# EAGLE design LTX-Rapidfire (EAGLE 7.7.0)

## Sheet 1 of 2
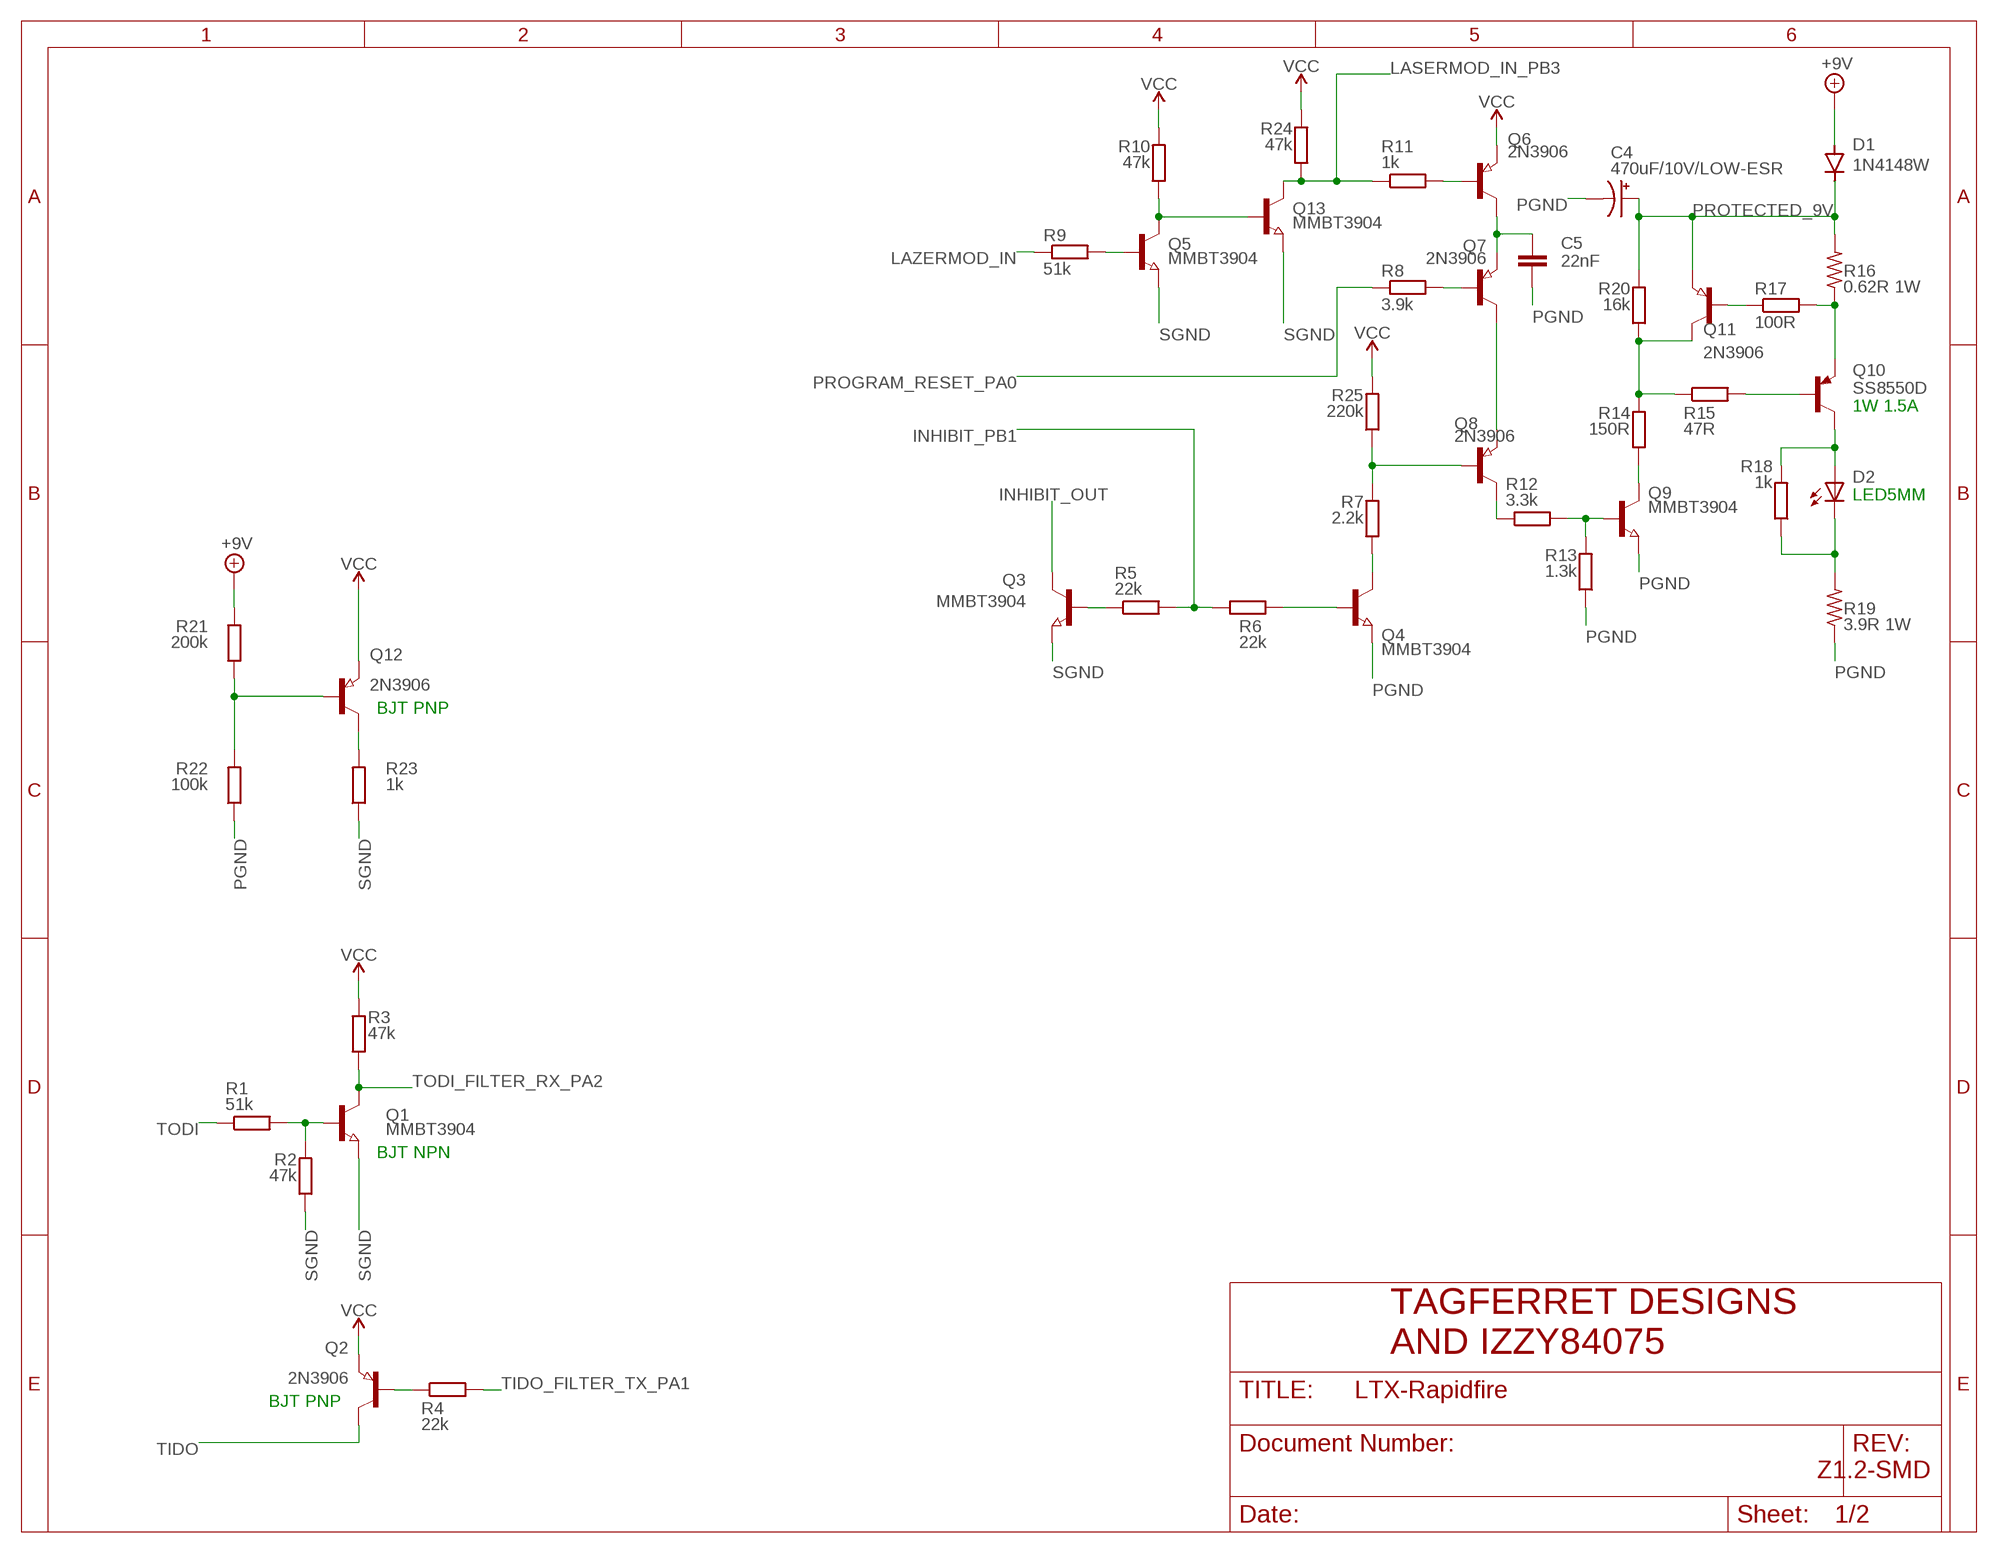
[diagram p0: schematic, sheet 1]

### Parts
C4  470uF/10V/LOW-ESR  CPOL-USE3.5-8  [E3,5-8]
C5  22nF  C_22NF/50V_0603  [C0603]
D1  1N4148W  D_1N4148W_ST_SOD123  [SOD123]
D2  LED5MM  [LED5MM]
Q1  MMBT3904  T_NPN_MMBT3904_CHANGJ_SOT23-BEC  [SOT23]
Q2  2N3906  T_PNP_MMBT5401_CHANGJ_SOT23-BEC  [SOT23]
Q3  MMBT3904  T_NPN_MMBT3904_CHANGJ_SOT23-BEC  [SOT23]
Q4  MMBT3904  T_NPN_MMBT3904_CHANGJ_SOT23-BEC  [SOT23]
Q5  MMBT3904  T_NPN_MMBT3904_CHANGJ_SOT23-BEC  [SOT23]
Q6  2N3906  T_PNP_MMBT5401_CHANGJ_SOT23-BEC  [SOT23]
Q7  2N3906  T_PNP_MMBT5401_CHANGJ_SOT23-BEC  [SOT23]
Q8  2N3906  T_PNP_MMBT5401_CHANGJ_SOT23-BEC  [SOT23]
Q9  MMBT3904  T_NPN_MMBT3904_CHANGJ_SOT23-BEC  [SOT23]
Q10  SS8550D  2N3906  [TO92]
Q11  2N3906  T_PNP_MMBT5401_CHANGJ_SOT23-BEC  [SOT23]
Q12  2N3906  T_PNP_MMBT5401_CHANGJ_SOT23-BEC  [SOT23]
Q13  MMBT3904  T_NPN_MMBT3904_CHANGJ_SOT23-BEC  [SOT23]
R1  51k  R_51K_0603  [R0603]
R2  47k  R_47K_0603  [R0603]
R3  47k  R_47K_0603  [R0603]
R4  22k  R_22K_0603  [R0603]
R5  22k  R_22K_0603  [R0603]
R6  22k  R_22K_0603  [R0603]
R7  2.2k  R_2.2K_0603  [R0603]
R8  3.9k  R_3.9K_0603  [R0603]
R9  51k  R_51K_0603  [R0603]
R10  47k  R_47K_0603  [R0603]
R11  1k  R_1K_0603  [R0603]
R12  3.3k  R_3.3K_0603  [R0603]
R13  1.3k  R_2.2K_0603  [R0603]
R14  150R  R_150R_0603  [R0603]
R15  47R  R_47R_0603  [R0603]
R16  0.62R 1W  R-US_R2512  [R2512]
R17  100R  R_100R_0603  [R0603]
R18  1k  R_1K_0603  [R0603]
R19  3.9R 1W  R-US_R2512  [R2512]
R20  16k  R_16K_0805  [R0805]
R21  200k  R_200K_0603  [R0603]
R22  100k  R_100K_0603  [R0603]
R23  1k  R_1K_0603  [R0603]
R24  47k  R_47K_0603  [R0603]
R25  220k  R_220K_0603  [R0603]

### Nets
+9V: D1.A R21.2 ; also sheet 2
INHIBIT_OUT: Q3.3(C) ; also sheet 2
INHIBIT_PB1: R5.2 R6.1 ; also sheet 2
LASERMOD_IN_PB3: Q13.3(C) R11.1 R24.1 ; also sheet 2
LAZERMOD_IN: R9.1 ; also sheet 2
N$1: Q11.1(B) R17.1
N$3: Q10.3(E) R16.1 R17.2
N$4: Q11.3(C) R14.2 R15.1 R20.1
N$5: Q10.2(B) R15.2
N$6: Q9.3(C) R14.1
N$7: D2.K(C) R18.1 R19.2
N$8: D2.A Q10.1(C) R18.2
N$9: Q9.1(B) R12.2 R13.2
N$10: Q8.3(C) R12.1
N$11: Q7.3(C) Q8.2(E)
N$12: Q8.1(B) R7.2 R25.1
N$13: Q7.1(B) R8.2
N$14: Q4.3(C) R7.1
N$15: C5.1 Q6.3(C) Q7.2(E)
N$16: Q4.1(B) R6.2
N$17: Q12.3(C) R23.2
N$18: Q3.1(B) R5.1
N$19: Q6.1(B) R11.2
N$20: Q12.1(B) R21.1 R22.2
N$21: Q5.3(C) Q13.1(B) R10.1
N$22: Q5.1(B) R9.2
N$24: Q1.1(B) R1.2 R2.2
N$25: Q2.1(B) R4.1
PGND: C4.- C5.2 Q4.2(E) Q9.2(E) R13.1 R19.1 R22.1 ; also sheet 2
PROGRAM_RESET_PA0: R8.1 ; also sheet 2
PROTECTED_9V: C4.+ D1.C Q11.2(E) R16.2 R20.2
SGND: Q1.2(E) Q3.2(E) Q5.2(E) Q13.2(E) R2.1 R23.1 ; also sheet 2
TIDO: Q2.3(C) ; also sheet 2
TIDO_FILTER_TX_PA1: R4.2 ; also sheet 2
TODI: R1.1 ; also sheet 2
TODI_FILTER_RX_PA2: Q1.3(C) R3.1 ; also sheet 2
VCC: Q2.2(E) Q6.2(E) Q12.2(E) R3.2 R10.2 R24.2 R25.2 ; also sheet 2

### Notes on the sheet
- 1W 1.5A
- LED5MM
- BJT PNP
- BJT NPN
- TAGFERRET DESIGNS
  AND IZZY84075
- BJT PNP
- Z1.2-SMD

## Sheet 2 of 2
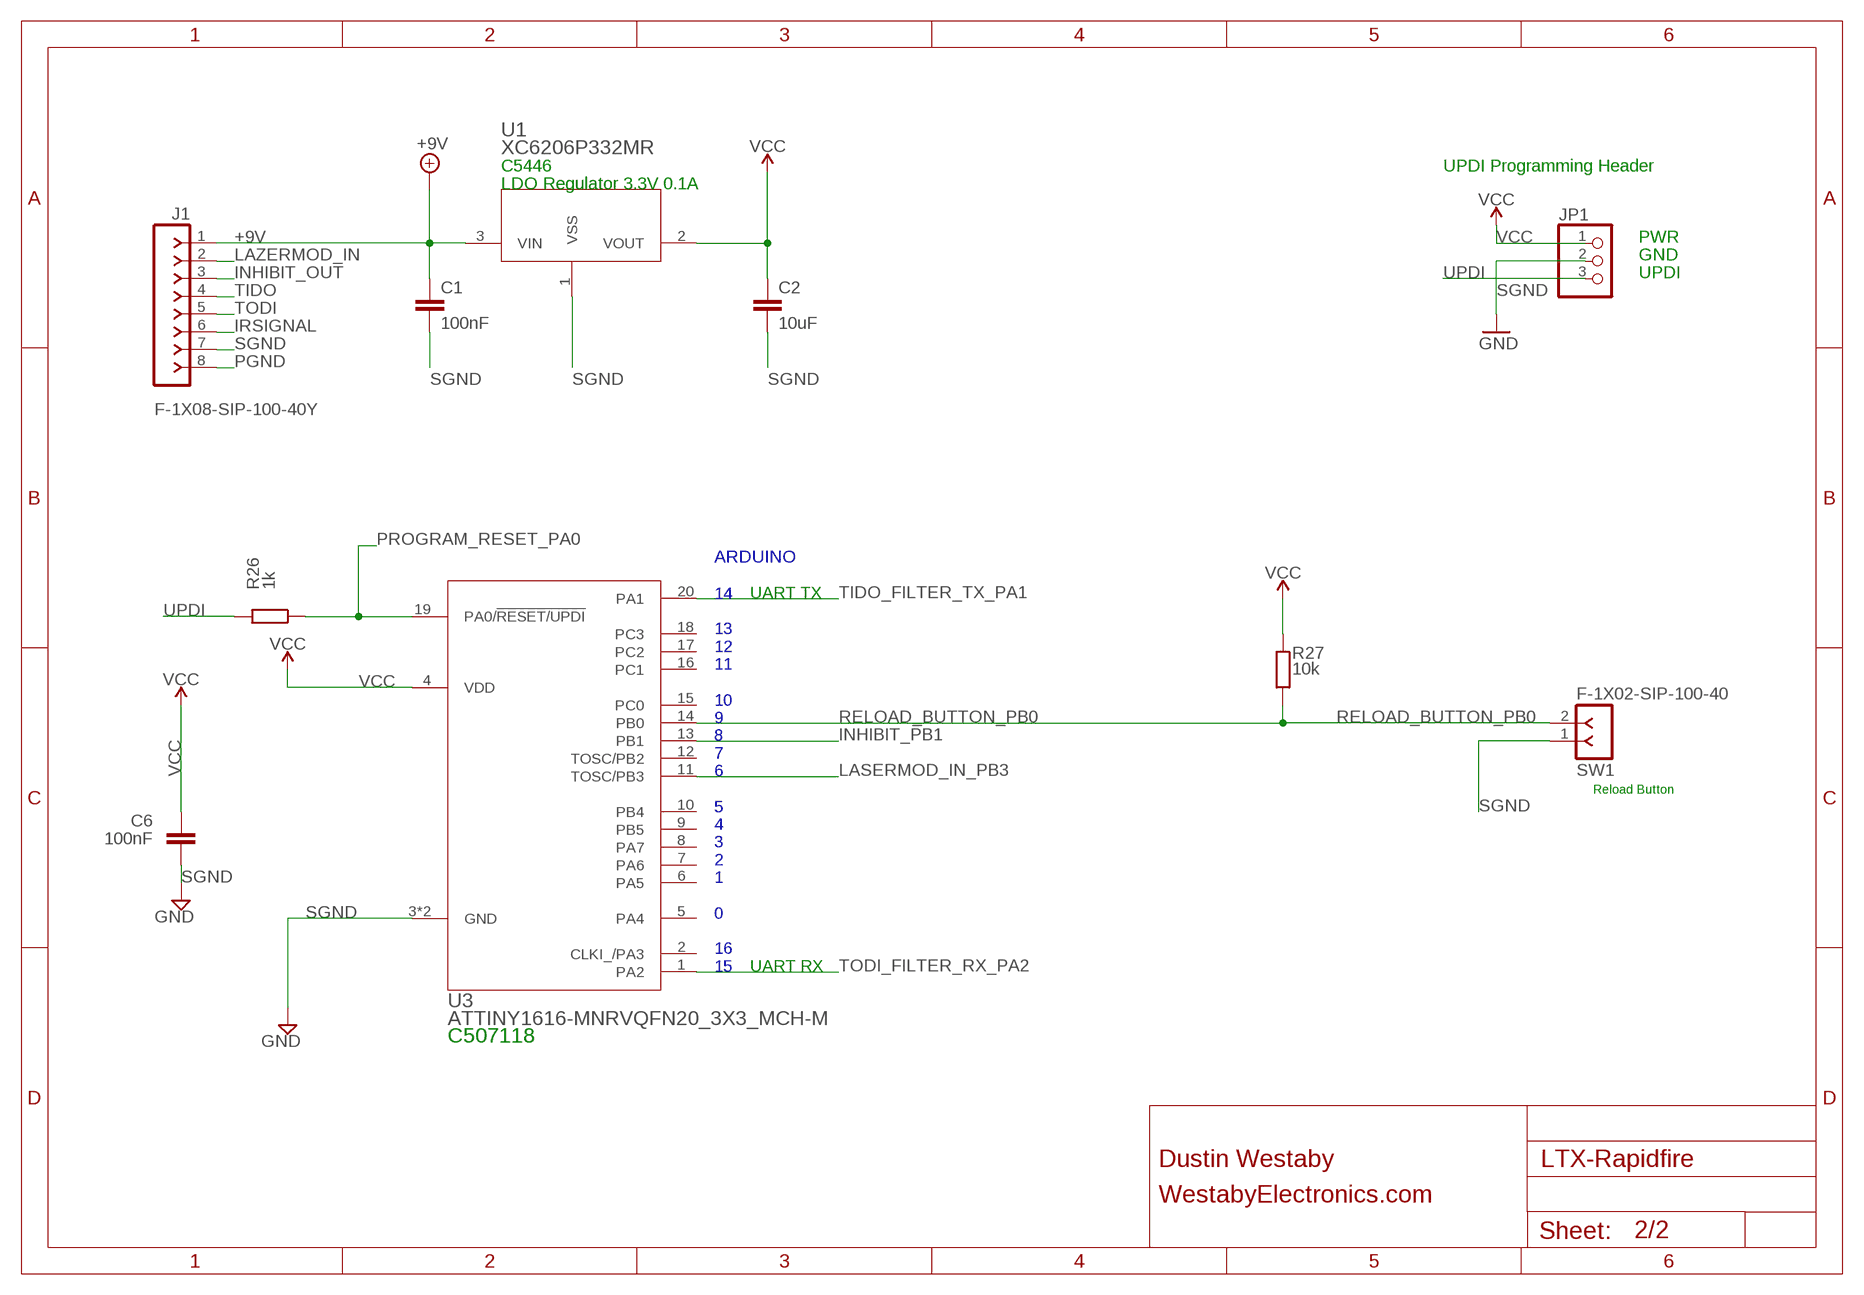
[diagram p1: schematic, sheet 2]

### Parts
C1  100nF  C_100NF/50V_0603  [C0603]
C2  10uF  C_10UF/25V_0603  [C0603]
C6  100nF  C_100NF/50V_0603  [C0603]
J1  F-1X08-SIP-100-40Y  [SIP-100-08-40Y]
JP1  PINHD-1X3  [1X03]
R26  1k  R_1K_0603  [R0603]
R27  10k  R_10K_0603  [R0603]
SW1  F-1X02-SIP-100-40  [SIP-100-02-40]
U1  XC6206P332MR  [SOT-23_TOR]
U3  ATTINY1616-MNRVQFN20_3X3_MCH-M  [VQFN20_3X3_MCH-M]

### Nets
+9V: C1.1 J1.1 U1.3(VIN) ; also sheet 1
INHIBIT_OUT: J1.3 ; also sheet 1
INHIBIT_PB1: U3.13(PB1) ; also sheet 1
IRSIGNAL: J1.6
LASERMOD_IN_PB3: U3.11(TOSC/PB3) ; also sheet 1
LAZERMOD_IN: J1.2 ; also sheet 1
PGND: J1.8 ; also sheet 1
PROGRAM_RESET_PA0: R26.1 U3.19(PA0/!RESET/UPDI) ; also sheet 1
RELOAD_BUTTON_PB0: R27.2 SW1.2 U3.14(PB0)
SGND: C1.2 C2.2 C6.2 J1.7 JP1.2 SW1.1 U1.1(VSS) U3.3(GND) U3.21(GND) ; supply symbol labelled GND ; also sheet 1
TIDO: J1.4 ; also sheet 1
TIDO_FILTER_TX_PA1: U3.20(PA1) ; also sheet 1
TODI: J1.5 ; also sheet 1
TODI_FILTER_RX_PA2: U3.1(PA2) ; also sheet 1
UPDI: JP1.3 R26.2
VCC: C2.1 C6.1 JP1.1 R27.1 U1.2(VOUT) U3.4(VDD) ; also sheet 1
Unconnected: U3.2(CLKI_/PA3) U3.5(PA4) U3.6(PA5) U3.7(PA6) U3.8(PA7) U3.9(PB5) U3.10(PB4) U3.12(TOSC/PB2) U3.15(PC0) U3.16(PC1) U3.17(PC2) U3.18(PC3)

### Notes on the sheet
- C5446 | UPDI Programming Header
- LDO Regulator 3.3V 0.1A
- PWR
- GND
- UPDI
- ARDUINO
- UART TX
- 14
  
  13
  12
  11
- 10
  9
  8
  7
  6
- Reload Button
- 5
  4
  3
  2
  1
- 0
  
  16
  15
- UART RX
- C507118
- Dustin Westaby
- WestabyElectronics.com

## Library data of the parts
C1 C6 = JLC PCB Basic Parts_loc:C_: Capacitor General purpose SMD Capacitor; LCSC_DATASHEET: https://datasheet.lcsc.com/lcsc/1809301912_YAGEO-CC0603KRX7R9BB104_C14663.pdf; LCSC_PART: C14663; LCSC_ROTATION_CCW: 0; LCSC_STOCK: 7111530; PROPERTIES: 50V 100nF X7R ±10% 0603 ROHS
C2 = JLC PCB Basic Parts_loc:C_: Capacitor General purpose SMD Capacitor; LCSC_DATASHEET: https://datasheet.lcsc.com/lcsc/1811110921_Samsung-Electro-Mechanics-CL10A106MA8NRNC_C96446.pdf; LCSC_PART: C96446; LCSC_ROTATION_CCW: 0; LCSC_STOCK: 119091; PROPERTIES: X5R 25V ±20% 10uF 0603 ROHS
C4 = rcl:CPOL-US: POLARIZED CAPACITOR, American symbol; LCSC: C43332; LCSC_PART: C43332
C5 = JLC PCB Basic Parts_loc:C_: Capacitor General purpose SMD Capacitor; LCSC_DATASHEET: https://datasheet.lcsc.com/lcsc/1811101610_Samsung-Electro-Mechanics-CL10B223KB8NNNC_C21122.pdf; LCSC_PART: C21122; LCSC_ROTATION_CCW: 0; LCSC_STOCK: 336043; PROPERTIES: 50V 22nF X7R ±10% 0603 ROHS
D1 = JLC PCB Basic Parts_loc:D_: Diode; LCSC_DATASHEET: https://datasheet.lcsc.com/lcsc/1811061725_ST-Semtech-1N4148W_C81598.pdf; LCSC_PART: C81598; LCSC_ROTATION_CCW: 180; LCSC_STOCK: 1139573; PROPERTIES: 75V +150°C@(Tj) 400mW Single 1.25V@150mA 4ns 1A@75V 150mA SOD-123 Switching Diode ROHS
D2 = led:LED: LED OSRAM: - CHIPLED LG R971, LG N971, LY N971, LG Q971, LY Q971, LO R971, LY R971 LH N974, LH R974 LS Q976, LO Q976, LY Q976 LO Q996 - Hyper CHIPLED LW Q18S LB Q993, LB Q99A, LB R99A - SideLED LS A670, LO A670, LY A670, LG A670, LP A670 LB A673, LV A673, LT A673, LW A673 LH A674 LY A675 LS A676, LA A676, LO A676, LY A676, LW A676 LS A679, LY A679, LG A679 - Hyper Micro SIDELED® LS Y876, LA Y876, LO Y876, LY Y876 LT Y87S - SmartLED LW L88C, LW L88S LB L89C, LB L89S, LG L890 LS L89K, LO L89K, LY L89K LS L896, LA L896, LO L896, LY L896 - TOPLED LS T670, LO T670, LY T670, LG T670, LP T670 LSG T670, LSP T670, LSY T670, LOP T670, LYG T670 LG T671, LOG T671, LSG T671 LB T673, LV T673, LT T673, LW T673 LH T674 LS T676, LA T676, LO T676, LY T676, LB T676, LH T676, LSB T676, LW T676 LB T67C, LV T67C, LT T67C, LS T67K, LO T67K, LY T67K, LW E67C LS E67B, LA E67B, LO E67B, LY E67B, LB E67C, LV E67C, LT E67C LW T67C LS T679, LY T679, LG T679 LS T770, LO T770, LY T770, LG T770, LP T770 LB T773, LV T773, LT T773, LW T773 LH T774 LS E675, LA E675, LY E675, LS T675 LS T776, LA T776, LO T776, LY T776, LB T776 LHGB T686 LT T68C, LB T68C - Hyper Mini TOPLED® LB M676 - Mini TOPLED Santana® LG M470 LS M47K, LO M47K, LY M47K Source: http://www.osram.convergy.de LUXEON: - LUMILED® LXK2-PW12-R00, LXK2-PW12-S00, LXK2-PW14-U00, LXK2-PW14-V00 LXK2-PM12-R00, LXK2-PM12-S00, LXK2-PM14-U00 LXK2-PE12-Q00, LXK2-PE12-R00, LXK2-PE12-S00, LXK2-PE14-T00, LXK2-PE14-U00 LXK2-PB12-K00, LXK2-PB12-L00, LXK2-PB12-M00, LXK2-PB14-N00, LXK2-PB14-P00, LXK2-PB14-Q00 LXK2-PR12-L00, LXK2-PR12-M00, LXK2-PR14-Q00, LXK2-PR14-R00 LXK2-PD12-Q00, LXK2-PD12-R00, LXK2-PD12-S00 LXK2-PH12-R00, LXK2-PH12-S00 LXK2-PL12-P00, LXK2-PL12-Q00, LXK2-PL12-R00 Source: www.luxeon.com KINGBRIGHT: KA-3528ASYC Source: www.kingbright.com
J1 = con-headers-jp:F-1X08-: FEMALE HEADER
JP1 = adafruit:PINHD-1X3: PIN HEADER
Q1 Q3-Q5 Q9 Q13 = JLC PCB Basic Parts_loc:T_NPN_: Transistor NPN; LCSC_DATASHEET: https://datasheet.lcsc.com/lcsc/1811011934_Changjiang-Electronics-Tech--CJ-MMBT3904_C20526.pdf; LCSC_PART: C20526; LCSC_ROTATION_CCW: 180; LCSC_STOCK: 1041615; PROPERTIES: 40V 200mW 200mA 100@10mA,1V 300MHz 300mV@50mA,5mA NPN +150°C@(Tj) SOT-23(SOT-23-3) Bipolar Transistors - BJT ROHS
Q2 Q6-Q8 Q11 Q12 = JLC PCB Basic Parts_loc:T_PNP_: Transistor PNP; LCSC_DATASHEET: https://datasheet.lcsc.com/lcsc/1810111520_KEC-Semicon-2N3906S-RTK-P_C147294.pdf; LCSC_PART: C147294; LCSC_ROTATION_CCW: 180; LCSC_STOCK: 367315; PROPERTIES: 40V 350mW 200mA 100@10mA,1V 250MHz 400mV@50mA,5mA PNP
Q10 = transistor-pnp:2N3906: PNP Transistor; LCSC_PART: C118551
R1 R9 = JLC PCB Basic Parts_loc:R_: Resistor General purpose SMD Resistor; LCSC_DATASHEET: https://datasheet.lcsc.com/lcsc/2110252130_UNI-ROYAL-Uniroyal-Elec-0603WAF5102T5E_C23196.pdf; LCSC_PART: C23196; LCSC_ROTATION_CCW: 0; LCSC_STOCK: 568423; PROPERTIES: ±1% 1/10W Thick Film Resistors 75V ±100ppm -55°C~+155°C 51kOhm 0603 ROHS
R2 R3 R10 R24 = JLC PCB Basic Parts_loc:R_: Resistor General purpose SMD Resistor; LCSC_DATASHEET: https://datasheet.lcsc.com/lcsc/2110260030_UNI-ROYAL-Uniroyal-Elec-0603WAF4702T5E_C25819.pdf; LCSC_PART: C25819; LCSC_ROTATION_CCW: 0; LCSC_STOCK: 1052947; PROPERTIES: ±1% 1/10W Thick Film Resistors 75V ±100ppm -55°C~+155°C 47kOhm 0603 ROHS
R4-R6 = JLC PCB Basic Parts_loc:R_: Resistor General purpose SMD Resistor; LCSC_DATASHEET: https://datasheet.lcsc.com/lcsc/2110260230_UNI-ROYAL-Uniroyal-Elec-0603WAF2202T5E_C31850.pdf; LCSC_PART: C31850; LCSC_ROTATION_CCW: 0; LCSC_STOCK: 342507; PROPERTIES: ±1% 1/10W Thick Film Resistors 75V ±100ppm -55°C~+155°C 22kOhm 0603 ROHS
R7 = JLC PCB Basic Parts_loc:R_: Resistor General purpose SMD Resistor; LCSC_DATASHEET: https://datasheet.lcsc.com/lcsc/2110251730_UNI-ROYAL-Uniroyal-Elec-0603WAF2201T5E_C4190.pdf; LCSC_PART: C4190; LCSC_ROTATION_CCW: 0; LCSC_STOCK: 331536; PROPERTIES: ±1% 1/10W Thick Film Resistors 75V ±100ppm -55°C~+155°C 2.2kOhm 0603 ROHS
R8 = JLC PCB Basic Parts_loc:R_: Resistor General purpose SMD Resistor; LCSC_DATASHEET: https://datasheet.lcsc.com/lcsc/2110252130_UNI-ROYAL-Uniroyal-Elec-0603WAF3901T5E_C23018.pdf; LCSC_PART: C23018; LCSC_ROTATION_CCW: 0; LCSC_STOCK: 210846; PROPERTIES: ±1% 1/10W Thick Film Resistors 75V ±100ppm -55°C~+155°C 3.9kOhm 0603 ROHS
R11 R18 R23 R26 = JLC PCB Basic Parts_loc:R_: Resistor General purpose SMD Resistor; LCSC_DATASHEET: https://datasheet.lcsc.com/lcsc/2110252030_UNI-ROYAL-Uniroyal-Elec-0603WAF1001T5E_C21190.pdf; LCSC_PART: C21190; LCSC_ROTATION_CCW: 0; LCSC_STOCK: 5175299; PROPERTIES: ±1% 1/10W Thick Film Resistors 75V ±100ppm -55°C~+155°C 1kOhm 0603 ROHS
R12 = JLC PCB Basic Parts_loc:R_: Resistor General purpose SMD Resistor; LCSC_DATASHEET: https://datasheet.lcsc.com/lcsc/2110252130_UNI-ROYAL-Uniroyal-Elec-0603WAF3301T5E_C22978.pdf; LCSC_PART: C22978; LCSC_ROTATION_CCW: 0; LCSC_STOCK: 1921362; PROPERTIES: ±1% 1/10W Thick Film Resistors 75V ±100ppm -55°C~+155°C 3.3kOhm 0603 ROHS
R13 = JLC PCB Basic Parts_loc:R_: Resistor General purpose SMD Resistor; LCSC_DATASHEET: https://datasheet.lcsc.com/lcsc/2206010130_UNI-ROYAL-Uniroyal-Elec-0603WAF1301T5E_C22767.pdf; LCSC_PART: C22767; LCSC_ROTATION_CCW: 0; LCSC_STOCK: 331536; PROPERTIES: 100mW Thick Film Resistors 75V ±100ppm/℃ ±1% -55℃~+155℃ 1.3kΩ
R14 = JLC PCB Basic Parts_loc:R_: Resistor General purpose SMD Resistor; LCSC_DATASHEET: https://datasheet.lcsc.com/lcsc/2110252030_UNI-ROYAL-Uniroyal-Elec-0603WAF1500T5E_C22808.pdf; LCSC_PART: C22808; LCSC_ROTATION_CCW: 0; LCSC_STOCK: 466893; PROPERTIES: ±1% 1/10W Thick Film Resistors 75V ±100ppm -55°C~+155°C 150Ohm 0603 ROHS
R15 = JLC PCB Basic Parts_loc:R_: Resistor General purpose SMD Resistor; LCSC_DATASHEET: https://datasheet.lcsc.com/lcsc/2110252130_UNI-ROYAL-Uniroyal-Elec-0603WAF470JT5E_C23182.pdf; LCSC_PART: C23182; LCSC_ROTATION_CCW: 0; LCSC_STOCK: 687203; PROPERTIES: ±1% 1/10W Thick Film Resistors 75V ±100ppm -55°C~+155°C 47Ohm 0603 ROHS
R16 = resistor:R-US_: RESISTOR, American symbol; LCSC_PART: C705623
R17 = JLC PCB Basic Parts_loc:R_: Resistor General purpose SMD Resistor; LCSC_DATASHEET: https://datasheet.lcsc.com/lcsc/2110252030_UNI-ROYAL-Uniroyal-Elec-0603WAF1000T5E_C22775.pdf; LCSC_PART: C22775; LCSC_ROTATION_CCW: 0; LCSC_STOCK: 3700009; PROPERTIES: ±1% 1/10W Thick Film Resistors 75V ±200ppm -55°C~+155°C 100Ohm 0603 ROHS
R19 = resistor:R-US_: RESISTOR, American symbol; LCSC_PART: C66801
R20 = JLC PCB Basic Parts_loc:R_: Resistor General purpose SMD Resistor; LCSC_DATASHEET: https://datasheet.lcsc.com/lcsc/2110251730_UNI-ROYAL-Uniroyal-Elec-0805W8F1602T5E_C17490.pdf; LCSC_PART: C17490; LCSC_ROTATION_CCW: 0; LCSC_STOCK: 5214; PROPERTIES: ±1% 1/8W Thick Film Resistors 150V ±100ppm -55°C~+155°C 16kOhm 0805 ROHS
R21 = JLC PCB Basic Parts_loc:R_: Resistor General purpose SMD Resistor; LCSC_DATASHEET: https://datasheet.lcsc.com/lcsc/2110260030_UNI-ROYAL-Uniroyal-Elec-0603WAF2003T5E_C25811.pdf; LCSC_PART: C25811; LCSC_ROTATION_CCW: 0; LCSC_STOCK: 665451; PROPERTIES: ±1% 1/10W Thick Film Resistors 75V ±100ppm -55°C~+155°C 200kOhm 0603 ROHS
R22 = JLC PCB Basic Parts_loc:R_: Resistor General purpose SMD Resistor; LCSC_DATASHEET: https://datasheet.lcsc.com/lcsc/2110260030_UNI-ROYAL-Uniroyal-Elec-0603WAF1003T5E_C25803.pdf; LCSC_PART: C25803; LCSC_ROTATION_CCW: 0; LCSC_STOCK: 5826279; PROPERTIES: ±1% 1/10W Thick Film Resistors 75V ±100ppm -55°C~+155°C 100kOhm 0603 ROHS
R25 = JLC PCB Basic Parts_loc:R_: Resistor General purpose SMD Resistor; LCSC_DATASHEET: https://datasheet.lcsc.com/lcsc/2110252130_UNI-ROYAL-Uniroyal-Elec-0603WAF2203T5E_C22961.pdf; LCSC_PART: C22961; LCSC_ROTATION_CCW: 0; LCSC_STOCK: 192313; PROPERTIES: ±1% 1/10W Thick Film Resistors 75V ±100ppm -55°C~+155°C 220kOhm 0603 ROHS
R27 = JLC PCB Basic Parts_loc:R_: Resistor General purpose SMD Resistor; LCSC_DATASHEET: https://datasheet.lcsc.com/lcsc/2110260030_UNI-ROYAL-Uniroyal-Elec-0603WAF1002T5E_C25804.pdf; LCSC_PART: C25804; LCSC_ROTATION_CCW: 0; LCSC_STOCK: 7979018; PROPERTIES: ±1% 1/10W Thick Film Resistors 75V ±100ppm -55°C~+155°C 10kOhm 0603 ROHS
SW1 = con-headers-jp:F-1X02-: FEMALE HEADER
U1 = LTX-Rapidfire:XC6206P332MR; COPYRIGHT: Copyright (C) 2022 Ultra Librarian. All rights reserved.; LCSC_PART: C5446; MANUFACTURER_PART_NUMBER: XC6206P332MR; MFR_NAME: Torex Semiconductor
U3 = attiny1616:ATTINY1616-MNR; COPYRIGHT: Copyright (C) 2022 Ultra Librarian. All rights reserved.; DIGI-KEY_PART_NUMBER_1: ATTINY1616-MNRCT-ND; DIGI-KEY_PART_NUMBER_2: ATTINY1616-MNRDKR-ND; DIGI-KEY_PART_NUMBER_3: ATTINY1616-MNRTR-ND; MANUFACTURER_PART_NUMBER: ATTINY1616-MNR; MFR_NAME: Microchip

## Net classes
0 default: width 0.152 mm, drill 0.305 mm, clearance 0.152 mm

## Board
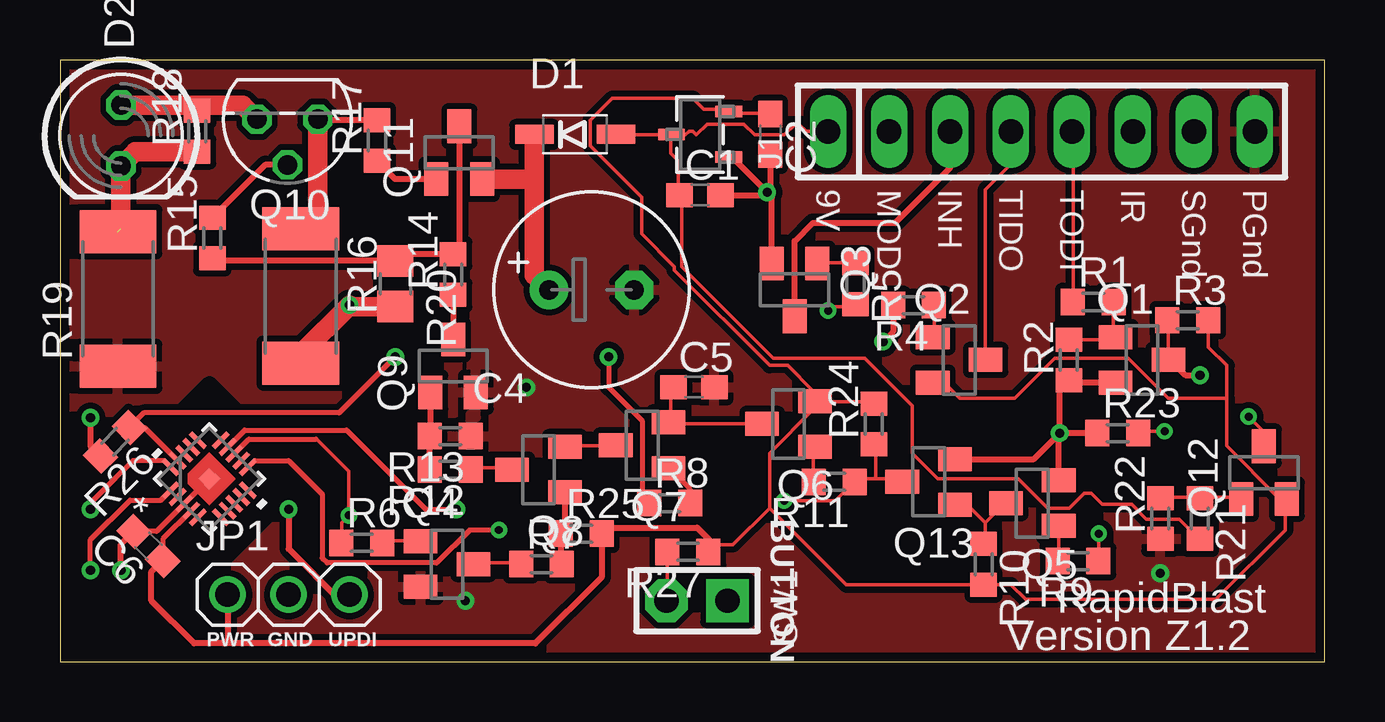
[diagram p2: board, top side]
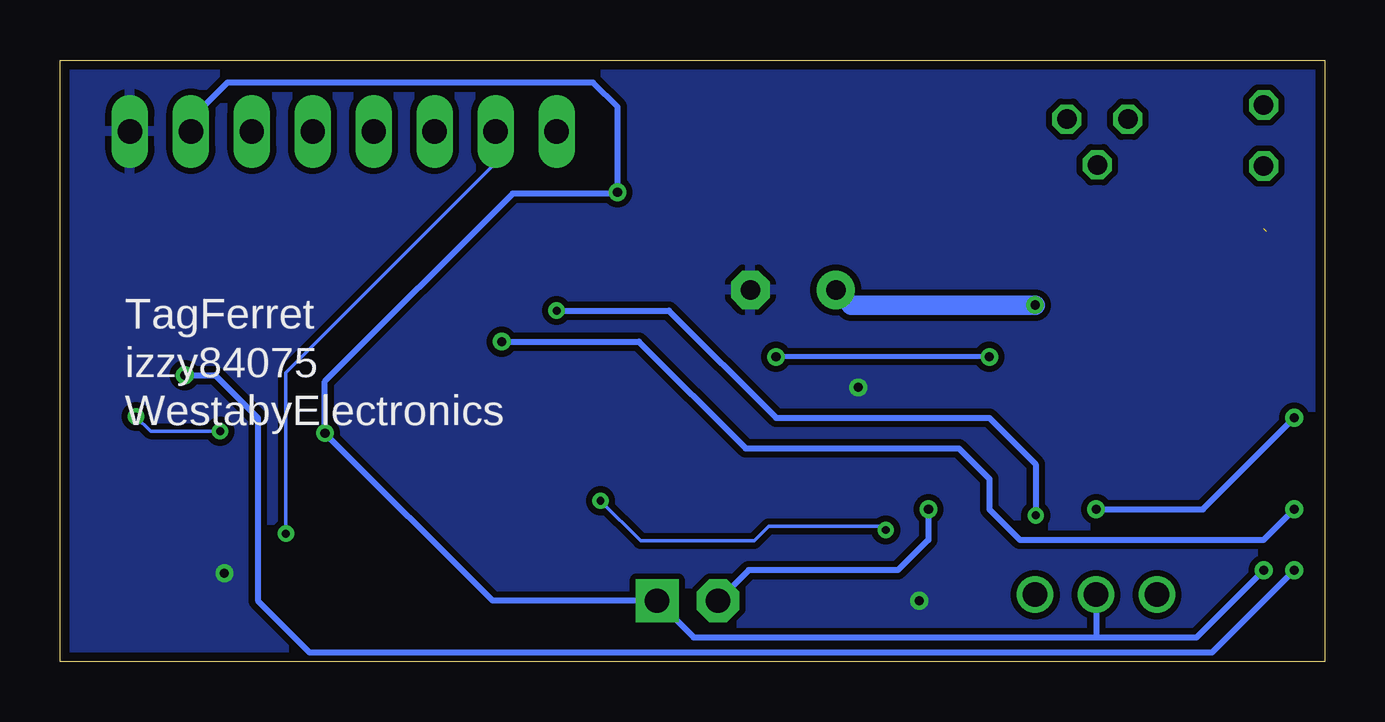
[diagram p3: board, bottom side, seen from below]

Size 52.7 x 25.07 mm. Coordinates in mm from the lower left corner, seen from the top.
Outline: 52.7,0 52.7,0
Outline: 52.7,0 52.7,25.07 0,25.07 0,0 52.7,0
Copper layers (1*16): Top 0.0356mm / dielectric 1.5011mm / Bottom 0.0356mm
Design rules "LaenPCBOrder *": minimum track width 6mil, minimum drill 13mil, track to track 6mil, track to pad 6mil, pad to pad 6mil, via to via 6mil, smd to smd 6mil, copper to edge 15mil, drill to drill 6mil, minimum pad ring 7mil, minimum via ring 7mil, stop-mask expansion 4mil, vias tented up to drill 25mil, thermal gap 10mil

### Footprints (pad centres in the part's own frame; a part is rotated, then mirrored left to right if it is on the bottom)
C0603 = smd 1.1 x 1: 1 -0.85,0; 2 0.85,0
E3,5-8 = drill 0.813 pad 1.6: + -1.778,0 | drill 0.813 pad 1.6 octagon: - 1.778,0
SOD123 = smd 1.6 x 0.8: A 1.7,0; C -1.7,0
LED5MM = drill 0.813 octagon: A -1.27,0; K 1.27,0
SIP-100-08-40Y = drill 1.016 long: 1 -8.89,0; 2 -6.35,0; 3 -3.81,0; 4 -1.27,0; 5 1.27,0; 6 3.81,0; 7 6.35,0; 8 8.89,0
1X03 = drill 1.016: 1 -2.54,0; 2 0,0; 3 2.54,0
SOT23 = smd 1.4 x 1: 1 -1.1,0.95; 2 -1.1,-0.95; 3 1.1,0
TO92 = drill 0.813 octagon: 1 1.27,0; 2 0,1.905; 3 -1.27,0
R0603 = smd 1 x 1.1: 1 -0.85,0; 2 0.85,0
R2512 = smd 1.8 x 3.2: 1 -2.8,0; 2 2.8,0
R0805 = smd 1.3 x 1.5: 1 -0.95,0; 2 0.95,0
SIP-100-02-40 = drill 1.016 pad 1.778 square: 1 -1.27,0 | drill 1.016 pad 1.778 octagon: 2 1.27,0
SOT-23_TOR = smd 0.483 x 1.118: 1 -0.95,-1.194; 2 0.95,-1.194; 3 0,1.194
VQFN20_3X3_MCH-M = smd 0.864 x 0.203: 1 -1.473,0.8; 2 -1.473,0.4; 3 -1.473,0; 4 -1.473,-0.4; 5 -1.473,-0.8; 11 1.473,-0.8; 12 1.473,-0.4; 13 1.473,0; 14 1.473,0.4; 15 1.473,0.8 | smd 0.203 x 0.864: 6 -0.8,-1.473; 7 -0.4,-1.473; 8 0,-1.473; 9 0.4,-1.473; 10 0.8,-1.473; 16 0.8,1.473; 17 0.4,1.473; 18 0,1.473; 19 -0.4,1.473; 20 -0.8,1.473 | smd 0.635 x 0.635: 21 0,0

### Placement (x,y rotation side)
C1  26.67,19.43 0 top
C2  29.59,21.97 270 top
C4  22.15,15.49 0 top
C5  26.42,11.43 0 top
C6  3.68,4.83 135 top
D1  21.46,21.97 0 top
D2  2.54,21.92 270 top
J1  40.89,22.1 0 top
JP1  9.53,2.79 0 top
Q1  45.09,12.57 0 top
Q2  37.47,12.57 0 top
Q3  30.61,15.49 270 top
Q4  16.13,4.06 0 top
Q5  40.51,6.6 180 top
Q6  30.35,9.91 180 top
Q7  24.26,9.02 180 top
Q8  19.94,8 180 top
Q9  16.38,12.32 90 top
Q10  9.47,22.61 180 top
Q11  16.64,21.21 90 top
Q12  50.16,7.87 90 top
Q13  36.2,7.49 180 top
R1  43.05,14.99 0 top
R2  42.04,12.57 90 top
R3  46.99,14.22 0 top
R4  35.56,14.86 180 top
R5  33.15,15.75 270 top
R6  12.57,4.95 0 top
R7  20.07,4.06 0 top
R8  25.4,6.6 0 top
R9  42.42,4.19 180 top
R10  38.48,4.06 270 top
R11  32.26,7.49 180 top
R12  16.26,8 180 top
R13  16.26,9.4 180 top
R14  16.38,16.13 90 top
R15  6.35,17.65 90 top
R16  10.03,15.24 270 top
R17  13.21,21.72 90 top
R18  5.71,22.1 90 top
R19  2.41,15.11 90 top
R20  13.97,15.75 270 top
R21  47.5,5.97 270 top
R22  45.85,5.97 90 top
R23  44.07,9.53 0 top
R24  33.91,9.91 90 top
R25  21.72,5.33 0 top
R26  2.29,9.16 225 top
R27  26.16,4.57 180 top
SW1  26.54,2.54 180 top
U1  26.67,21.97 90 top
U3  6.22,7.62 45 top

### Tracks (layer width: path | path; a pad name or v marks a point on that pad's centre or on a via)
+9V
  Top 0.152: 25.45,21.95 25.45,21.18 25.76,20.88 25.76,19.51 C1.1 25.91,19.36 25.91,16.46 29.72,12.65 33.53,12.65 35.51,10.67 35.51,8.69 36.58,7.62 39.93,7.62 41.15,6.4 42.06,6.4 42.67,7.01 42.98,7.01 43.43,6.55 44.65,6.55 45.26,5.94 46.63,5.94 47.4,5.18 R21.2 | 25.45,21.95 23.16,21.95 D1.A | 25.45,21.95 U1.3 25.6,21.95 26.06,21.95 26.21,22.1 26.36,22.1 26.52,21.95 26.98,22.4 28.5,22.4 28.96,21.95 30.18,21.95 30.63,22.4 30.79,22.4 31.09,22.1 J1.1
INHIBIT_OUT
  Top 0.254: Q3.3 30.61,17.53 31.37,18.29 34.8,18.29 37.08,20.57 J1.3
INHIBIT_PB1  (via drill 0.33)
  Top 0.152: v32,14.63 32.16,14.78 33.07,14.78 R5.2 | R6.1 11.73,5.03 11.73,5.79 v12.04,6.1 12.04,7.93 10.67,9.3 10.67,9.27
  Top 0.203: U3.13 7.87,9.27 10.67,9.27
  Bottom 0.254: v32,14.63 27.33,14.63 22.86,10.16 13.97,10.16 12.04,8.23 v12.04,6.1
LASERMOD_IN_PB3  (via drill 0.33)
  Top 0.152: 33.98,7.62 35.05,7.62 Q13.3 | 33.98,7.62 33.22,7.62 R11.1 33.07,7.47 32.31,6.71 v30.18,6.71 | 33.98,7.62 33.98,8.99 R24.1
  Top 0.203: U3.11 8.12,8.38 9.53,8.38 10.92,6.99 10.92,4.32 10.97,4.27 11.12,4.12 15.7,4.12 17.07,5.49 v18.29,5.49
  Bottom 0.152: v18.29,5.49 18.44,5.64 23.16,5.64 23.77,5.03 28.5,5.03 v30.18,6.71
LAZERMOD_IN  (via drill 0.33)
  Top 0.152: v43.28,5.33 43.28,4.27 R9.1
  Bottom 0.152: v43.28,5.33 43.28,12.04 34.59,20.73 34.59,22.1 J1.2
N$1
  Top 0.254: Q11.1 13.97,20.11 R17.1
N$3
  Top 0.254: R17.2 10.78,22.57 Q10.3
  Top 0.813: Q10.3 10.74,18.75 R16.1
N$4
  Top 0.254: R15.1 6.46,16.7 R20.1 14.25,16.98 R14.2 16.64,17.23 Q11.3
N$5
  Top 0.254: Q10.2 8.55,20.7 R15.2
N$6
  Top 0.254: R14.1 Q9.3
N$7  (1 unrouted)
  Top 0.813: R18.1 3.14,21.25 D2.K 2.54,18.04
N$8
  Top 0.813: D2.A 5.71,23.19 | 5.71,23.19 7.62,23.19 Q10.1 | R18.2 5.71,23.19
N$9
  Top 0.254: R12.2 R13.2 15.43,9.43 Q9.1
N$10
  Top 0.152: R12.1 17.22,8.08 18.75,8.08 Q8.3
N$11
  Top 0.152: Q8.2 21.18,8.99 23.01,8.99 Q7.3
N$12
  Top 0.254: Q8.1 21.04,5.51 R25.1 20.87,4.11 R7.2
N$13
  Top 0.203: R8.2 26.25,7.17 Q7.1
N$14
  Top 0.152: R7.1 19.2,4.12 17.37,4.12 Q4.3
N$15
  Top 0.152: C5.1 25.45,11.43 25.45,10.06 Q7.2 25.45,9.91 Q6.3
N$16
  Top 0.152: R6.2 13.56,5.03 14.94,5.03 Q4.1
N$17  (via drill 0.33)
  Top 0.152: v46.02,9.6 44.96,9.6 R23.2 | v49.53,10.21 50.14,9.6 50.14,8.99 Q12.3
  Bottom 0.152: v46.02,9.6 48.92,9.6 v49.53,10.21
N$18
  Top 0.152: R5.1 33.07,16.61 31.7,16.61 Q3.1
N$19
  Top 0.152: R11.2 31.39,7.62 31.39,8.84 Q6.1
N$20
  Top 0.152: R22.2 45.87,6.86 47.4,6.86 R21.1 47.55,6.86 49.07,6.86 Q12.1
N$21
  Top 0.152: 38.56,5.79 38.56,5.03 R10.1 | 38.56,5.79 39.32,6.55 Q5.3 | 38.56,5.79 37.95,6.4 37.34,6.4 Q13.1
N$22
  Top 0.152: R9.2 41.6,4.27 Q5.1
N$24
  Top 0.152: R2.2 42.06,13.41 43.89,13.41 Q1.1 43.89,13.56 43.89,14.94 R1.2
N$25
  Top 0.152: R4.1 36.42,14.78 36.42,13.56 Q2.1
PGND  (via drill 0.38)
  other vias: 45.85,3.68 16.89,2.54 19.43,11.43
  pour Top (isolate 0.254): 52.7,25.07 52.7,0 0,0 0,25.07
  pour Bottom (isolate 0.254): 52.7,25.07 52.7,0 0,0 0,25.07
PROGRAM_RESET_PA0  (via drill 0.38)
  Top 0.203: U3.19 3.52,9.76 R26.1 3.49,10.36 11.63,10.36 v13.97,12.7 | v22.86,12.7 22.86,11.43 24.26,10.03 24.26,6.9 R8.1
  Bottom 0.203: v13.97,12.7 v22.86,12.7
PROTECTED_9V  (via drill 0.38)
  Top 0.813: D1.C 19.76,20.32 | 19.76,20.32 19.76,16.1 C4.+ | Q11.2 19.55,20.11 19.76,20.32 | R20.2 12.13,14.8 v12.06,14.86 10.03,12.83 R16.2
  Bottom 0.813: v12.06,14.86 19.74,14.86 C4.+
RELOAD_BUTTON_PB0  (via drill 0.38)
  Top 0.152: R27.2 25.3,4.72 25.3,2.59 SW1.2
  Top 0.203: U3.14 7.69,9.65 11.94,9.65 15.24,6.35 v16.51,6.35
  Bottom 0.152: 25.3,2.59 SW1.2
  Bottom 0.254: v16.51,6.35 16.51,5.08 17.78,3.81 24,3.81 SW1.2
SGND  (via drill 0.38)
  Top 0.203: C6.2 4.03,5.43 U3.3 U3.21
  Top 0.254: v41.66,9.53 41.66,11.34 R2.1 42.14,11.62 Q1.2 | Q5.2 41.61,9.48 v41.66,9.53 | Q13.2 40.57,8.44 v41.66,9.53 | C2.2 29.59,19.69 v29.46,19.56 | U1.1 28,21.02 v29.46,19.56 | C1.2 29.34,19.43 v29.46,19.56 | R23.1 v41.66,9.53 | Q3.2 29.66,19.37 v29.46,19.56 | v2.54,3.81 2.54,4.89 C6.2
  Bottom 0.152: 29.57,19.51 v29.46,19.56
  Bottom 0.254: v29.46,19.56 29.46,23.11 30.48,24.13 45.72,24.13 47.24,22.61 J1.7 | 29.57,19.51 33.83,19.51 41.66,11.68 v41.66,9.53 34.67,2.54 SW1.1 26.29,1.02 9.53,1.02 | 9.53,1.02 5.33,1.02 v2.54,3.81 | JP1.2 9.53,1.02
TIDO
  Top 0.152: J1.4 39.62,20.73 38.56,19.66 38.56,12.65 Q2.3
TIDO_FILTER_TX_PA1  (via drill 0.38)
  Top 0.203: U3.20 4.33,8.38 3.05,8.38 2.29,7.62 1.27,6.6 v1.27,6.35
  Top 0.254: R4.2 34.71,13.76 v34.29,13.34
  Bottom 0.254: v34.29,13.34 28.57,13.34 24.13,8.89 15.24,8.89 13.97,7.62 13.97,6.35 12.7,5.08 2.54,5.08 v1.27,6.35
TODI
  Top 0.152: R1.1 42.22,15.09 42.22,22.1 J1.5
TODI_FILTER_RX_PA2  (via drill 0.38)
  Top 0.152: R3.1 46.18,14.17 46.18,12.65 Q1.3
  Top 0.203: 4.33,6.86 U3.1 4.2,6.73 2.92,6.73 1.27,5.08 v1.27,3.81
  Top 0.254: 46.18,12.65 46.89,11.94 v47.5,11.94
  Bottom 0.254: v47.5,11.94 46.23,11.94 44.45,10.16 44.45,2.54 42.29,0.38 4.7,0.38 v1.27,3.81
UPDI  (via drill 0.38)
  Top 0.254: v1.27,10.16 1.27,8.98 R26.2 | v9.53,6.35 9.53,4.7 11.68,2.54 11.81,2.54 JP1.3
  Bottom 0.254: v9.53,6.35 5.08,6.35 v1.27,10.16
VCC
  Top 0.152: 48.62,10.97 48.62,8.99 50.75,6.86 51.05,6.86 Q12.2 51.05,6.71 51.05,5.49 48.16,2.59 40.23,2.59 39.62,3.2 38.56,3.2 R10.2 38.41,3.2 32.77,3.2 29.57,6.4 | 48.62,10.97 48.62,12.34 47.85,13.11 47.85,14.17 R3.2 | 48.62,10.97 46.18,10.97 44.5,12.65 41.45,12.65 39.78,10.97 37.49,10.97 36.88,11.58 36.42,11.58 Q2.2 | C2.1 29.57,22.86 27.89,22.86 U1.2 27.74,23.01 26.82,23.01 26.36,23.47 23.01,23.47 22.1,22.56 22.1,21.49 24.23,19.36 24.23,17.83 25.6,16.46 25.6,16.31 29.57,12.34 30.33,12.34 31.39,11.28 31.39,10.97 Q6.2 | 29.57,6.4 28.04,4.88 27.13,4.88 R27.1 26.98,4.88 | 29.57,6.4 29.57,8.69 31.39,10.52 31.39,10.82 Q6.2 | R24.2 33.83,10.82 31.55,10.82 Q6.2
  Top 0.203: U3.4 4.28,5.12 C6.1
  Top 0.254: R27.1 27.05,4.61 27.05,5.08 26.54,5.59 22.86,5.59 22.61,5.33 R25.2 22.57,3.52 19.81,0.76 6.86,0.76 | 6.86,0.76 5.59,0.76 3.81,2.54 3.81,3.75 C6.1 | JP1.1 6.99,0.89 6.86,0.76

### Text on the board
tPlace: 9V | MOD | INH | TIDO | TODI | IR | SGnd | PGnd | BUTTON | RapidBlast | PWR | GND | UPDI | Version Z1.2
bPlace: TagFerret | izzy84075 | WestabyElectronics
tNames: SW9V | LAZR | !INH | TIDO | TODI | (NC) | SGND | PGND